# Altium schematic sheet Power.SchDoc
size Letter
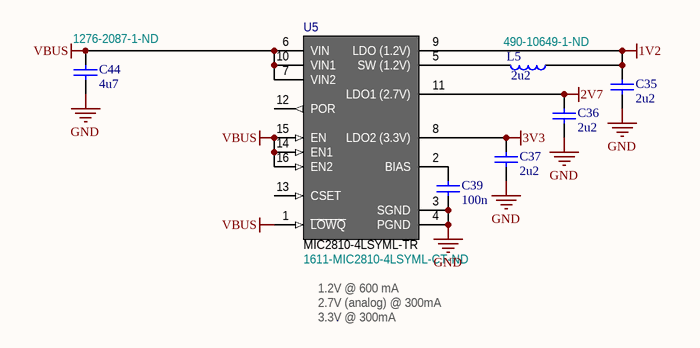
[diagram p0: Power.SchDoc]

## Parts
C35  2u2  [CAPC1005N]
C36  2u2  [CAPC1005N]
C37  2u2  [CAPC1005N]
C39  100n  [CAPC0603N]
C44  4u7  Supplier Part Number 1: 1276-2087-1-ND  [CAPC1608N]
L5  value 2u2  Supplier Part Number 1: 490-10649-1-ND  [INDC2520X12N]  (hidden comment: Inductor)
U5  MIC2810-4LSYML-TR  Supplier Part Number 1: 1611-MIC2810-4LSYML-CT-ND  [QFN50P300X300X90-16N]

## Nets
1V2: C35.2 L5.1 U5.9(LDO_(1.2V))
2V7: C36.2 U5.11(LDO1_(2.7V))
3V3: C37.2 U5.8(LDO2_(3.3V))
GND: C35.1 C36.1 C37.1 C39.2 C44.1 U5.3(SGND) U5.4(PGND)
VBUS: C44.2 U5.1(~{LOWQ}) U5.6(VIN) U5.7(VIN2) U5.10(VIN1) U5.14(EN1) U5.15(EN) U5.16(EN2)
NetC39_1: C39.1 U5.2(BIAS)
NetL5_2: L5.2 U5.5(SW_(1.2V))

Not connected (* = marked no-connect by the designer): U5 12(POR) 13(CSET)

## Notes on the sheet
- 1.2V @ 600 mA
- 2.7V (analog) @ 300mA
- 3.3V @ 300mA

## Library data of the parts
C35-C37 C39 C44 = Cap Semi: Capacitor (Semiconductor SIM Model); Published: 8-Jun-2000; LatestRevisionDate: 29-May-2009; LatestRevisionNote: IPC-7351 Footprint Added.; PackageReference: C1206; Publisher: Altium Limited; PackageDescription: Chip Capacitor
  C39: Supplier 1: Digi-Key; Supplier Part Number 1: 490-5405-1-ND
  C44: Supplier 1: Digi-Key
L5 = Inductor: Code_IEC: 1005; Published: 8-Jun-2000; LatestRevisionDate: 29-May-2009; LatestRevisionNote: IPC-7351 Footprint Added.; PackageReference: 0402-A; Publisher: Altium Limited; PackageDescription: Chip Inductor; Code_JEITA: 0402; Supplier 1: Digi-Key
U5 = MIC2810-4LSYML-TR: IC REG TRPL BUCK/LINEAR 16-MLF; Manufacturer: Microchip Technology; Topology: Step-Down (Buck) (1), Linear (LDO) (2); Function: Any Function; Number of Outputs: 3; Frequency - Switching: 2MHz; Voltage/Current - Output 1: 1.2V, 600mA; Voltage/Current - Output 2: 2.7V, 300mA; Voltage/Current - Output 3: 3.3V, 300mA; w/LED Driver: No; Voltage - Supply: 1.65 V ~ 5.5 V; Supplier 1: Digi-Key; Manufacturer Part Number: MIC2810-4LSYML-TR; RoHS: RoHS Compliant; Category: Integrated Circuits (ICs); Stock 1: 3543; Pricing 1: 1=2.61, 25=2.178, 100=2.106 (USD); Packaging: Cut Tape (CT); Part Status: Discontinued at Digi-Key; w/Supervisor: No; w/Sequencer: No; Operating Temperature: -40°C ~ 85°C; Mounting Type: Surface Mount; Package / Case: 16-VFQFN, 16-MLF®; Supplier Device Package: 16-MLF® (4x4); ComponentLink1URL: http://www.microchip.com/mymicrochip/filehandler.aspx?ddocname=en580544; ComponentLink1Description: http://www.microchip.com/mymicrochip/filehandler.aspx?ddocname=en580544